# EasyEDA Pro project luoye-recorder-pcb-2026-07-16.epro, board AI BOARD
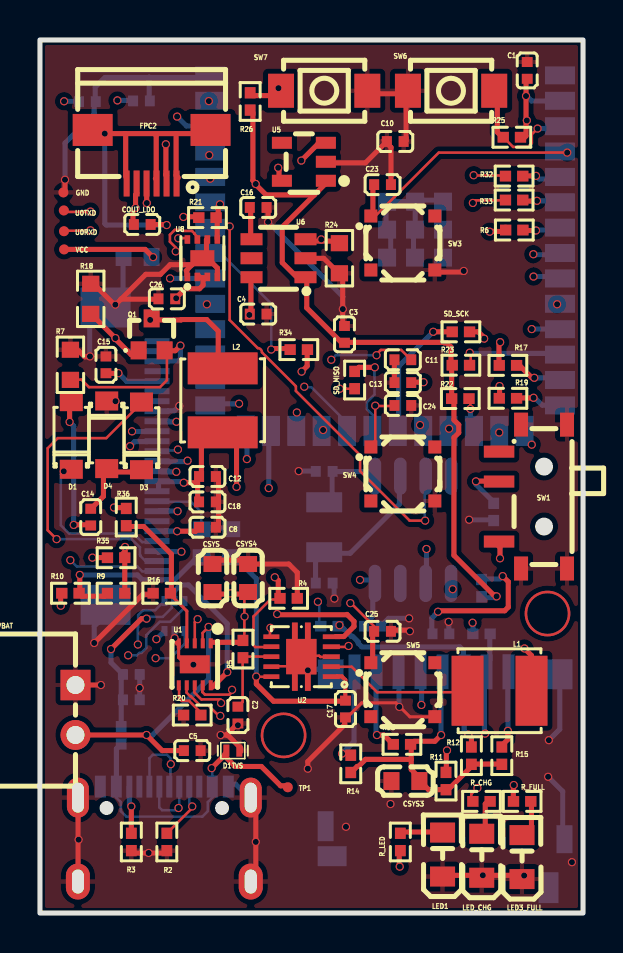
[diagram p2: board, top side]
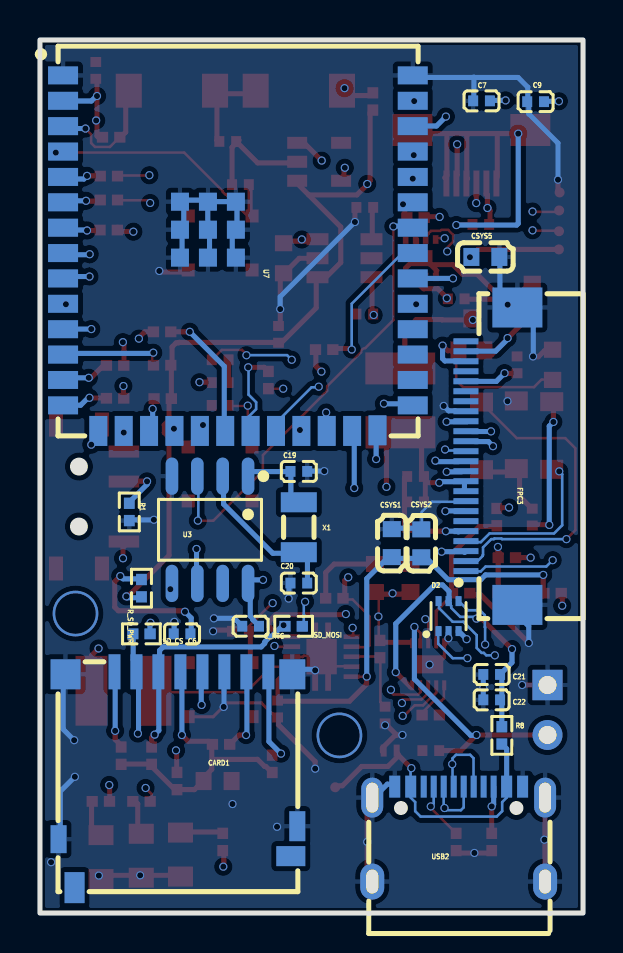
[diagram p3: board, bottom side, seen from below]

Outline 27.18 x 43.69 mm; copper layers: Top Layer, Inner1, Inner2, Inner3, Inner4, Bottom Layer. Coordinates in mm from the lower left corner of the outline.
Outline path: rectangle 0,43.69 27.18,0
Stack: Top Layer 0.035mm Outer layer thickness 1oz / Dielectric1 0.0994mm 3313 RC57% 4.2mil / Inner1 0.0152mm Inner layer thickness / Dielectric2 0.55mm 0.55mm H/H No copper / Inner2 0.0152mm Inner layer thickness / Dielectric3 0.1088mm 2116 RC54% 4.9mil / Inner3 0.0152mm Inner layer thickness / Dielectric4 0.55mm 0.55mm H/H No copper / Inner4 0.0152mm Inner layer thickness / Dielectric5 0.0994mm 3313 RC57% 4.2mil / Bottom Layer 0.035mm Outer layer thickness 1oz

## Design rules (mm)
spacing copperThickness1oz (default): track to track 0.102, other pairs 0.152 to 0.3
spacing copperThickness2oz: track to track 0.203, other pairs 0.152 to 0.3
track width copperThickness1oz (default): min 0.127, default 0.254, max 2.54
track width copperThickness2oz: min 0.203, default 0.254, max 2.54
differential pair differentialPair (default): width min 0.127, default 0.254, max 2.54; gap min 0.152, default 0.152
net GND uses copperRegion

## Placement (name value [footprint] x y rotation side)
C1  1uF  [C0402]  24.38 42.16 90 top
C2  100nF  [C0402]  9.91 9.91 270 top
C3  100nF  [C0402]  15.24 28.96 270 top
C4  1uF  [C0402]  10.92 29.97 180 top
C5  1uF  [C0402]  7.62 8.13 0 top
C6  100nF  [C0402]  20.07 13.97 180 bottom
C7  1uF  [C0402]  5.08 40.64 180 bottom
C8  1uF  [C0402]  8.38 19.3 180 top
C9  1uF  [C0402]  2.37 40.6 180 bottom
C10  1uF  [C0402]  17.78 38.61 0 top
C11  1uF  [C0402]  18.16 27.69 0 top
C12  4.7uF  [C0402]  8.38 21.84 0 top
C13  1uF  [C0402]  18.16 26.54 0 top
C14  4.7uF  [C0402]  2.54 19.81 90 top
C15  1uF  [C0402]  3.3 27.43 90 top
C16  10nF  [C0402]  10.92 35.31 180 top
C17  1uF  [C0402]  15.29 10.21 90 top
C18  4.7uF  [C0402]  8.38 20.57 180 top
C19  12pF  [C0402]  14.22 22.1 0 bottom
C20  12pF  [C0402]  14.22 16.51 180 bottom
C21  2.2uF  [C0402]  4.57 11.94 180 bottom
C22  100nF  [C0402]  4.57 10.67 180 bottom
C23  100nF  [C0402]  17.14 36.45 0 top
C24  100nF  [C0402]  18.16 25.4 0 top
C25  100nF  [C0402]  17.14 14.1 0 top
C26  100nF  [C0402]  6.35 30.73 0 top
C_RTC  100nF  [C0402]  16.64 14.35 0 bottom
CARD1  DM3D-SF  [TF-SMD_DM3D-SF]  20.27 6.67 0 bottom
CN_VBAT  ZX-XH2.54-2PWZ  [CONN-TH_2P-P2.50_ZX-XH2.54-2PWZ]  1.78 10.16 270 top
COUT_LDO  1uF  [C0402]  5.12 34.46 180 top
CSYS  10uF  [C0603]  8.64 16.76 270 top
CSYS1  10uF  [C0603]  9.57 18.51 270 bottom
CSYS2  10uF  [C0603]  8.09 18.5 270 bottom
CSYS3  10uF  [C0603]  18.29 6.6 0 top
CSYS4  10uF  [C0603]  10.41 16.76 90 top
CSYS5  10uF  [C0603]  4.89 32.83 0 bottom
D1  MBR0530  [SOD-123_L2.8-W1.8-LS3.7-RD]  1.57 23.9 90 top
D1TVS  H5VL10B  [SOD-882_L1.0-W0.6-BI]  9.65 8.13 180 top
D2  USBLC6-2P6-MS  [SOT-666-6_L1.6-W1.2-P0.50-LS1.6-BL]  6.73 14.86 180 bottom
D3  MBR0530  [SOD-123_L2.8-W1.8-LS3.7-RD]  5.08 23.88 90 top
D4  MBR0530  [SOD-123_L2.8-W1.8-LS3.7-RD]  3.34 23.93 270 top
FPC2  AFC01-S06FCA-00  [FPC-SMD_P0.50-6P_AFC01-S06FCA-00]  5.59 37.85 180 top
FPC3  FPC-05F-24PH20  [FPC-SMD_24P-P0.50_FPC-05F-24PH20]  4.57 22.86 90 bottom
GND  -  [Test-Point-0.5mm]  1.17 36.06 0 top
L1  2.2uH  [IND-SMD_L4.0-W4.0]  23 11.12 180 top
L2  47uH  [IND-SMD_L4.0-W4.0]  9.14 25.65 270 top
LED1  NCD0805R1  [LED0805-RD]  20.15 2.93 90 top
LED3_FULL  NCD0805R1  [LED0805-RD]  24.12 2.8 90 top
LED_CHG  NCD0805R1  [LED0805-RD]  22.11 2.87 90 top
Q1  SI1308EDL-VB  [SOT-323_L2.0-W1.3-P1.30-LS2.1-BR]  5.59 28.96 270 top
R1  100kΩ  [R0402]  22.71 20.07 90 bottom
R2  5.1kΩ  [R0402]  6.35 3.56 90 top
R3  5.1kΩ  [R0402]  4.57 3.56 270 top
R4  100kΩ  [R0402]  12.45 15.75 180 top
R5  100Ω  [R0402]  10.16 13.21 270 top
R6  100kΩ  [R0402]  23.74 34.18 0 top
R7  2.2Ω  [R0603]  1.52 27.43 270 top
R8  0Ω  [R0402]  4.06 8.89 90 bottom
R9  10kΩ  [R0402]  3.81 16 0 top
R10  10kΩ  [R0402]  1.52 16 0 top
R11  10kΩ  [R0402]  20.32 6.6 270 top
R12  10kΩ  [R0402]  21.59 7.87 270 top
R13  10kΩ  [R0402]  18.11 8.44 0 top
R14  10kΩ  [R0402]  15.55 7.47 270 top
R15  10kΩ  [R0402]  23.11 7.87 270 top
R16  10kΩ  [R0402]  6.1 16 180 top
R17  0Ω  [R0402]  23.42 27.41 0 top
R18  1MΩ  [R0603]  2.54 30.73 270 top
R19  0Ω  [R0402]  23.42 25.76 0 top
R20  10kΩ  [R0402]  7.62 9.91 0 top
R21  10kΩ  [R0402]  8.38 34.8 0 top
R22  10kΩ  [R0402]  21.04 25.74 0 top
R23  10kΩ  [R0402]  21.06 27.41 0 top
R24  100kΩ  [R0603]  14.99 32.77 90 top
R25  10kΩ  [R0402]  23.62 38.82 0 top
R26  10kΩ  [R0402]  10.52 40.61 270 top
R32  22Ω  [R0402]  23.73 36.87 180 top
R33  22Ω  [R0402]  23.73 35.68 180 top
R34  0Ω  [R0402]  12.95 28.19 0 top
R35  0Ω  [R0402]  3.81 17.78 0 top
R36  0Ω  [R0402]  4.32 19.81 270 top
R_CHG  2.2kΩ  [R0402]  22.1 5.59 0 top
R_FULL  2.2kΩ  [R0402]  24.13 5.59 0 top
R_LED  2.2kΩ  [R0402]  18.03 3.56 90 top
R_SD_PWR  0Ω  [R0402]  22.1 16.26 90 bottom
SD_CS  22Ω  [R0402]  22.1 13.97 0 bottom
SD_MISO  22Ω  [R0402]  15.75 26.67 270 top
SD_MOSI  22Ω  [R0402]  14.48 14.35 0 bottom
SD_SCK  22Ω  [R0402]  21.07 29.08 0 top
SW1  MSK12C02  [SW-TH_MSK12C02]  24.68 20.84 90 top
SW3  U34B352210  [SW-SMD_4P-L3.7-W3.7-P2.70-LS3.7]  18.16 33.53 0 top
SW4  U34B352210  [SW-SMD_4P-L3.7-W3.7-P2.70-LS3.7]  18.16 21.97 0 top
SW5  U34B352210  [SW-SMD_4P-L3.7-W3.7-P2.70-LS3.7]  18.16 11.18 0 top
SW6  HX 3x4x2-2P-1.6N TACTILE SWITCH  [KEY-SMD_L4.0-W3.0-LS4.9-1]  20.57 41.15 0 top
SW7  HX 3x4x2-2P-1.6N TACTILE SWITCH  [KEY-SMD_L4.0-W3.0-LS4.9-1]  14.22 41.15 180 top
TP1  -  [Test-Point-0.5mm]  12.4 6.29 90 top
U0RXD  -  [Test-Point-0.5mm]  1.2 34.12 0 top
U0TXD  -  [Test-Point-0.5mm]  1.19 35.16 0 top
U1  BQ25186DLHR  [WSON-10_L2.2-W2.0-P0.40-BL-EP_TI_DLH0010A]  7.75 12.45 180 top
U2  TPS63001DRCR  [VSON-10_L3.0-W3.0-P0.50-TL-EP_TPS62410DRCR]  13.08 12.83 180 top
U3  PCF8563T(UMW)  [SOP-8_L4.9-W3.9-P1.27-LS6.0-BL]  18.67 19.18 0 bottom
U5  TPS7A2033PDBVR  [SOT-23-5_L2.9-W1.6-P0.95-LS2.8-BR]  13.21 37.59 0 top
U6  TPS22918DBVR  [SOT-23-6_L2.9-W1.6-P0.95-LS2.8-BR]  11.94 32.77 0 top
U7  2.4GHz  [WIRELM-SMD_ESP32-S3-WROOM-1U]  17.27 33.02 180 bottom
U8  MAX17048G+T10  [TDFN-8_L2.0-W2.0-P0.50-BL-EP1.2]  8.13 32.77 0 top
USB2  TYPE-C 16PIN 2MD(073)  [USB-C-SMD_TYPE-C-16PIN-2MD-073]  6.22 3.95 180 bottom
VCC  -  [Test-Point-0.5mm]  1.21 33.21 270 top
X1  32.768kHz  [FC-135R_L3.2-W1.5]  14.22 19.3 90 bottom

## Footprints (pads in the part's own frame, mm; a bottom-side part is the same pattern mirrored in y, then rotated)
C0402
  rect 0.5x0.54 smd: 1(-0.42,0) 2(0.42,0)
C0603
  rect 0.8x0.9 smd: 1(-0.7,0) 2(0.7,0)
CONN-TH_2P-P2.50_ZX-XH2.54-2PWZ
  rect 1.524x1.5 hole 0.9: 1(-1.25,0)
  round 1.5 hole 0.9: 2(1.25,0)
FC-135R_L3.2-W1.5
  rect 1x1.8 smd: 1(-1.25,0) 2(1.25,0)
FPC-SMD_24P-P0.50_FPC-05F-24PH20
  rect 0.3x1.25 smd: 1(-5.75,1.288) 2(-5.25,1.288) 3(-4.75,1.288) 4(-4.25,1.288) 5(-3.75,1.288) 6(-3.25,1.288) 7(-2.75,1.288) 8(-2.25,1.288) 9(-1.75,1.288) 10(-1.25,1.288) 11(-0.75,1.288) 12(-0.25,1.288) 13(0.25,1.288) 14(0.75,1.288) 15(1.25,1.288) 16(1.75,1.288) 17(2.25,1.288) 18(2.75,1.288) 19(3.25,1.288) 20(3.75,1.288) 21(4.25,1.288) 22(4.75,1.288) 23(5.25,1.288) 24(5.75,1.288)
  rect 2x2.5 smd: 25(7.44,-1.288) 26(-7.44,-1.288)
FPC-SMD_P0.50-6P_AFC01-S06FCA-00
  rect 0.3x1.3 smd: 1(-1.248,1.339) 2(-0.748,1.339) 3(-0.248,1.339) 4(0.252,1.339) 5(0.752,1.339) 6(1.252,1.339)
  rect 2x1.6 smd: 7(-2.95,-1.339) 8(2.95,-1.339)
IND-SMD_L4.0-W4.0
  rect 1.6x3.5 smd: 1(-1.6,0) 2(1.6,0)
KEY-SMD_L4.0-W3.0-LS4.9-1
  rect 1.3x1.7 smd: 1(-2.159,0) 2(2.159,0)
LED0805-RD
  rect 1x1.25 smd: 1(-1.1,0) 2(1.1,0)
R0402
  rect 0.566x0.54 smd: 1(-0.433,0) 2(0.433,0)
R0603
  rect 0.806x0.864 smd: 1(-0.753,0) 2(0.753,0)
SOD-123_L2.8-W1.8-LS3.7-RD
  rect 0.95x1.15 smd: 1(-1.692,0) 2(1.692,0)
SOD-882_L1.0-W0.6-BI
  rect 0.3x0.6 smd: 1(-0.325,0) 2(0.325,0)
SOP-8_L4.9-W3.9-P1.27-LS6.0-BL
  oval 0.63x1.865 smd: 1(-1.905,-2.683) 2(-0.635,-2.683) 3(0.635,-2.683) 4(1.905,-2.683) 5(1.905,2.683) 6(0.635,2.683) 7(-0.635,2.683) 8(-1.905,2.683)
SOT-23-5_L2.9-W1.6-P0.95-LS2.8-BR
  rect 1x0.6 smd: 1(1.1,-0.95) 2(1.1,0) 3(1.1,0.95) 4(-1.1,0.95) 5(-1.1,-0.95)
SOT-23-6_L2.9-W1.6-P0.95-LS2.8-BR
  rect 1.1x0.6 smd: 1(1.35,-0.95) 2(1.35,0) 3(1.35,0.95) 4(-1.35,0.95) 5(-1.35,0) 6(-1.35,-0.95)
SOT-323_L2.0-W1.3-P1.30-LS2.1-BR
  rect 0.9x0.8 smd: 1(0.8,-0.65) 2(0.8,0.65) 3(-0.8,0)
SOT-666-6_L1.6-W1.2-P0.50-LS1.6-BL
  rect 0.3x0.5 smd: 1(-0.5,-0.75) 2(0,-0.75) 3(0.5,-0.75) 4(0.5,0.75) 5(0,0.75) 6(-0.5,0.75)
SW-SMD_4P-L3.7-W3.7-P2.70-LS3.7
  rect 0.65x0.65 smd: 1(-1.6,1.35) 2(1.6,1.35) 3(-1.6,-1.35) 4(1.6,-1.35)
SW-TH_MSK12C02
  rect 0.6x1.524 smd: 1(-2.25,1.7) 2(0.75,1.7) 3(2.25,1.7)
  rect 1.2x0.7 smd: 4(-3.6,0.6) 4(-3.6,-1.7) 4(3.6,0.6) 4(3.6,-1.7)
TDFN-8_L2.0-W2.0-P0.50-BL-EP1.2
  rect 0.28x0.425 smd: 1(-0.75,-0.938) 2(-0.25,-0.938) 3(0.25,-0.938) 4(0.75,-0.938) 5(0.75,0.938) 6(0.25,0.938) 7(-0.25,0.938) 8(-0.75,0.938)
  rect 1.2x0.8 smd: 9(0,0)
Test-Point-0.5mm
  round 0.5 smd: 1(0,0)
TF-SMD_DM3D-SF
  rect 0.6x1.75 smd: 1(3.175,-5.4) 2(2.075,-5.4) 3(0.975,-5.4) 4(-0.125,-5.4) 5(-1.225,-5.4) 6(-2.325,-5.4) 7(-3.425,-5.4) 8(-4.525,-5.4)
  rect 1.45x1 smd: 9(-5.65,3.825)
  rect 1x1.55 smd: 10(5.175,5.4)
  rect 0.8x1.5 smd: 11(-5.975,2.325)
  rect 0.8x1.4 smd: 12(5.975,2.975)
  rect 1.5x1.5 smd: 13(5.625,-5.275)
  rect 1.3x1.5 smd: 14(-5.725,-5.275)
USB-C-SMD_TYPE-C-16PIN-2MD-073
  oval 1.2x1.8 hole 0.6x1.2: 13(-4.325,-2.375) 14(4.325,-2.375)
  oval 1.1x2 hole 0.6x1.5: 13(-4.325,1.825) 14(4.325,1.825)
  rect 0.55x1.1 smd: A1B12(-3.2,2.375) A4B9(-2.4,2.375) B1A12(3.2,2.375) B4A9(2.4,2.375)
  rect 0.3x1.1 smd: A5(-1.25,2.375) A6(-0.25,2.375) A7(0.25,2.375) A8(1.25,2.375) B5(1.75,2.375) B6(0.75,2.375) B7(-0.75,2.375) B8(-1.75,2.375)
VSON-10_L3.0-W3.0-P0.50-TL-EP_TPS62410DRCR
  rect 0.85x0.24 smd: 1(-1.5,1) 2(-1.5,0.5) 3(-1.5,0) 4(-1.5,-0.5) 5(-1.5,-1)
  rect 0.8x0.23 smd: 6(1.5,-1) 7(1.5,-0.5) 8(1.5,0) 9(1.5,0.5) 10(1.5,1)
  custom 1.52x3.42 smd: 11(0,-0.005)
WIRELM-SMD_ESP32-S3-WROOM-1U
  rect 1.5x0.9 smd: 1(-8.75,8.895) 2(-8.75,7.625) 3(-8.75,6.355) 4(-8.75,5.085) 5(-8.75,3.815) 6(-8.75,2.545) 7(-8.75,1.275) 8(-8.75,0.005) 9(-8.75,-1.265) 10(-8.75,-2.535) 11(-8.75,-3.805) 12(-8.75,-5.075) 13(-8.75,-6.345) 14(-8.75,-7.615) 27(8.75,-7.615) 28(8.75,-6.345) 29(8.75,-5.075) 30(8.75,-3.805) 31(8.75,-2.535) 32(8.75,-1.265) 33(8.75,0.005) 34(8.75,1.275) 35(8.75,2.545) 36(8.75,3.815) 37(8.75,5.085) 38(8.75,6.355) 39(8.75,7.625) 40(8.75,8.895)
  rect 0.9x1.5 smd: 15(-6.985,-8.895) 16(-5.715,-8.895) 17(-4.445,-8.895) 18(-3.175,-8.895) 19(-1.905,-8.895) 20(-0.635,-8.895) 21(0.635,-8.895) 22(1.905,-8.895) 23(3.175,-8.895) 24(4.445,-8.895) 25(5.715,-8.895) 26(6.985,-8.865)
  rect 0.9x0.9 smd: 41(-2.9,-0.225) 41(-2.9,1.175) 41(-2.9,2.575) 41(-1.5,-0.225) 41(-1.5,1.175) 41(-1.5,2.575) 41(-0.1,-0.225) 41(-0.1,1.175) 41(-0.1,2.575)
WSON-10_L2.2-W2.0-P0.40-BL-EP_TI_DLH0010A
  rect 0.2x0.5 smd: 1(-0.8,-1.05) 2(-0.4,-1.05) 3(0,-1.05) 4(0.4,-1.05) 5(0.8,-1.05) 6(0.8,1.05) 7(0.4,1.05) 8(0,1.05) 9(-0.4,1.05) 10(-0.8,1.05)
  rect 1.5x0.9 smd: 11(0,0)

## Nets
3.3V_MIC: COUT_LDO.2 FPC2.5 U5.5
AGND: COUT_LDO.1 FPC2.1 FPC2.3 FPC2.6 FPC2.7 FPC2.8 R6.1
GND: C1.2 C2.2 C3.1 C4.1 C5.2 C6.1 C7.1 C8.1 C9.1 C10.1 C10.2 C11.1 C12.2 C13.1 C15.2 C16.1 C17.1 C18.1 C19.1 C20.1 C21.1 C22.1 C23.2 C24.2 C25.2 C26.1 C_RTC.2 CARD1.6 CARD1.11 CARD1.12 CARD1.13 CARD1.14 CN_VBAT.1 CSYS.1 CSYS1.1 CSYS2.1 CSYS3.1 CSYS4.2 CSYS5.1 D1TVS.1 D2.2 D4.1 FPC3.8 FPC3.17 FPC3.25 FPC3.26 GND.1 LED1.1 LED3_FULL.1 LED_CHG.1 R1.1 R2.1 R3.2 R4.1 R7.1 R16.2 R18.1 R20.1 R24.1 SW1.4 SW3.4 SW4.4 SW5.4 SW6.1 SW7.1 U1.5 U1.11 U2.3 U2.9 U2.11 U3.4 U5.2 U6.2 U7.1 U7.40 U7.41 U8.1 U8.4 U8.6 U8.9 USB2.13 USB2.14 USB2.A1B12 USB2.B1A12
VBAT+: C26.2 C_RTC.1 U3.8 U8.2 U8.3
VCC: C1.1 C3.2 C17.2 CSYS1.2 CSYS2.2 CSYS5.2 R9.1 R10.2 R21.1 R22.1 R23.1 R25.2 R26.2 R_SD_PWR.1 U2.1 U2.10 U5.1 U6.1 U7.2 VCC.1
VCC_EPD: C4.2 C12.1 C18.2 FPC3.9 FPC3.10 L2.2 U6.6
VCC_SD: C6.2 CARD1.4 CSYS3.2 R11.2 R12.2 R13.2 R14.2 R15.2 R_SD_PWR.2
BACK_KEY: C25.1 SW5.1 U7.39
BAT+: C5.1 CN_VBAT.2 U1.2
BAT_ALRT: R21.2 U7.35 U8.5
BOOT: R26.1 SW7.2 U7.27
BQ_CE_N: R16.1 R36.2 U1.4
BQ_INT_N: R9.2 R35.2 U1.9
BQ_PG_N: R10.1 R34.2 U1.3
CHG_LED: R_CHG.1 U7.9
EPD_BUSY: FPC3.16 U7.22
EPD_CS: FPC3.13 U7.18
EPD_DC: FPC3.14 U7.11
EPD_MOSI: FPC3.11 U7.16
EPD_POWER_EN: R24.2 U6.3 U7.24
EPD_RST: FPC3.15 U7.23
EPD_SCLK: FPC3.12 U7.15
FULL_LED: R_FULL.1 U7.26
GDR: FPC3.23 Q1.1 R18.2
I2C_SCL: R22.2 U1.7 U3.6 U7.17 U8.7
I2C_SDA: R23.2 U1.8 U3.5 U7.12 U8.8
MARK_KEY: C24.1 SW4.1 U7.38
MIC_LDO_EN: R6.2 U5.3 U7.7
PDM_CLK: FPC2.2 R32.2
PDM_DATA: FPC2.4 R33.2
PREVGH: C13.2 D1.1 FPC3.4
PREVGL: D3.2 FPC3.2
PWR_MODE: R4.2 U2.7 U7.8
REC_KEY: C23.1 SW3.1 U7.4
REC_LED: R_LED.1 U7.25
RESE: FPC3.22 Q1.2 R7.2
RESET: R25.1 SW6.2 U7.3
RTC_INT: U3.3 U7.34
SD_CS: SD_CS.1 U7.10
SD_MISO: SD_MISO.1 U7.21
SD_MOSI: SD_MOSI.1 U7.19
SD_SCK: SD_SCK.1 U7.20
SYS_PWR: CSYS.2 CSYS4.1 R5.1 SW1.1 U1.1 U2.5
USB_5V_PROT: C21.2 C22.2 D2.5 R8.2 U1.10
USB_D+: D2.6 R19.1
USB_D-: D2.4 R17.1
VCOM: C11.2 FPC3.1
$1N2: D1TVS.2 R8.1 TP1.1 USB2.A4B9 USB2.B4A9
$1N5: D2.1 USB2.A6 USB2.B6
$1N6: D2.3 USB2.A7 USB2.B7
$1N18: R2.2 USB2.A5
$1N43: R1.2 SW1.2 U2.6
$1N49: C2.1 R5.2 U2.8
$1N50: L1.1 U2.4
$1N51: L1.2 U2.2
$1N121: CARD1.2 R11.1 SD_CS.2
$1N122: CARD1.3 R12.1 SD_MOSI.2
$1N123: CARD1.5 SD_SCK.2
$1N125: CARD1.1 R15.1
$1N127: CARD1.7 R13.1 SD_MISO.2
$1N184: C7.2 FPC3.7
$1N185: C8.2 FPC3.5
$1N188: C9.2 FPC3.3
$1N199: C14.2 D3.1 D4.2
$1N200: C14.1 D1.2 L2.1 Q1.3
$1N212: C15.1 FPC3.20
$1N218: C16.2 U6.4
$1N241: CARD1.8 R14.1
$1N256: C20.2 U3.2 X1.1
$1N257: C19.2 U3.1 X1.2
$1N288: LED1.2 R_LED.2
$1N294: LED_CHG.2 R_CHG.2
$1N297: LED3_FULL.2 R_FULL.2
$1N309: R20.2 U1.6
$1N348: U0RXD.1 U7.36
$1N355: U0TXD.1 U7.37
$1N383: R32.1 U7.5
$1N385: R33.1 U7.6
$1N388: R34.1 U7.33
$1N390: R35.1 U7.32
$1N392: R36.1 U7.31
$1N397: R17.2 U7.13
$1N398: R19.2 U7.14
$1N405: R3.1 USB2.B5

Pads without a net: CARD1 9 10; FPC3 6 18 19 21 24; SW1 3; SW3 2 3; SW4 2 3; SW5 2 3; U3 7; U5 4; U6 5; U7 28 29 30; USB2 A8 B8

## Via types
v1: diameter 2.286, hole 2.032, Top Layer to Bottom Layer, 2 vias
v2: diameter 0.409, hole 0.305, Top Layer to Bottom Layer, 177 vias

## Routing (per net, layer and track width the routed paths; a pad name or vN(x,y) marks a point on that pad's centre or on a via; arc(x,y) is an arc through that point)
3.3V_MIC: length 10.8
  Top Layer w0.254: 11.89,37.25 11.96,37.18 11.96,36.65 ; 4.66,34.5 4.66,35.15 v2(4.78,35.28) 4.78,35.94 4.85,36.01
  Inner1 w0.254: v2(11.92,37.29) 5.73,37.29 4.78,36.35 v2(4.78,35.28)
AGND: length 45
  Top Layer w0.254: 5.77,38.95 5.82,38.9 5.82,36.75 5.78,36.75 ; 6.92,36.79 6.81,36.9 6.81,39 ; 8.18,39.06 8.12,39 6.81,39 ; v2(6.34,34.43) 6.32,34.45 5.55,34.45 ; 4.26,39 4.29,38.97 4.29,36.84 ; 4.26,39 4.25,39.01 ; 4.26,39 6.81,39 ; 4.26,39 v2(3.24,39) ; 22.59,34.11 23.09,34.11 23.3,34.32
  Inner2 w0.254: 3.19,39.04 3.22,39.01 22.33,39.01 22.51,38.83 v2(22.51,34.09)
  Bottom Layer w0.254: v2(6.34,34.43) 3.32,34.43 3.24,34.5 v2(3.24,39)
GND: length 130.1
  Top Layer w0.127: 14.31,12.85 14.27,12.81 14.03,12.81 13.97,12.87 13.57,12.87 ; 11.89,12.35 12.81,12.35 12.93,12.47
  Top Layer w0.152: 6.94,13.5 6.94,12.79 7.11,12.61 ; 19.66,9.82 18.51,9.82 17.81,10.52 16.1,10.52 15.38,9.8
  Top Layer w0.254: 2.5,27.83 2.24,27.83 1.94,28.13 1.58,28.13 ; 6.73,13.77 6.73,13.66 6.91,13.48 ; 9.33,8.91 C2.2 ; 9.33,8.91 9.39,8.91 10.04,8.26 10.04,8.08 ; 9.33,8.91 v2(9.04,8.91) ; v2(2.71,13.51) 5.13,15.93 5.63,15.93 ; 16.53,41 18.27,41 18.33,41.06 ; 1.91,5.02 1.91,1.48 ; 14.83,32.13 14.2,32.76 13.5,32.76 ; 15.11,31.89 15.15,31.85 15.15,29.44 ; 14.07,37.54 16.28,37.54 17.32,38.57 ; 8.48,17.66 10.16,17.66 10.39,17.44 ; 2.62,31.55 3.73,30.44 ; 15.25,9.76 15.25,9.42 13.41,7.58 v2(13.41,7.22) ; 7.32,32.15 7.62,32.44 ; 7.62,32.44 7.97,32.8 ; 7.62,32.44 6.51,32.44 6.03,31.96 5.3,31.96 4.05,30.71 ; 24.34,1.69 24.14,1.89 v2(22.16,1.89) 20.03,1.89 ; 1.25,36.11 v2(1.25,36.7) ; v2(11.42,34.58) 11.42,35.2 11.34,35.27 ; 18.32,40.62 18.32,38.65 18.25,38.58 ; 10.8,5.52 v2(10.8,3.56) 10.8,1.66 10.54,1.4 ; 8.88,31.95 8.88,32.27 8.44,32.71 ; 8.79,19.3 8.94,19.45 8.94,21.78 ; v2(21.21,32.13) 21.15,32.07 19.81,32.07 ; 17.32,38.57 17.21,38.67 ; 17.32,38.57 17.57,38.32 17.57,36.46 ; 10.67,17.46 12.46,17.46 12.88,17.04 12.88,15.83 ; 3.81,30.48 4.05,30.71 ; 4.05,30.71 5.8,30.71 ; 8.33,33.71 8.33,32.87 ; v2(18.51,14.1) 18.46,14.16 17.57,14.16 ; 6.47,3.03 6.44,3 4.69,3 ; 17.74,27.58 17.74,26.48 17.77,26.44 ; 7.35,31.91 7.35,32.11 ; v2(3.05,11.41) CN_VBAT.1
  Inner2 w0.254: v2(3.78,25.61) 4.01,25.37 v2(6.97,25.37)
  Bottom Layer w0.127: 8.07,19.29 8.07,20.06 7.56,20.58 6.02,20.58
  Bottom Layer w0.254: 20.29,32.86 20.07,33.08 20.07,33.99 ; v2(25.47,8.65) 26.01,9.19 26.01,11.71 ; 19.98,35.59 19.98,34.21 ; 3.22,14.85 2.71,14.35 v2(2.71,13.51) ; C21.1 v2(4.99,11.26) C22.1 ; 9.55,6.45 9.79,6.45 10.58,5.66 ; 6.72,13.76 6.75,13.79 6.75,14.03 ; 17.97,11.49 17.97,10.33 v2(17.98,10.31) ; 17.42,32.86 17.55,33 17.55,33.96 ; 3.76,30.45 4.16,30.85 4.16,32.84 ; v2(14.73,15.73) 14.72,15.75 14.72,16.52 ; 18.69,34.05 18.69,32.85 18.78,32.76 ; 5.46,40.73 5.46,41.81 ; 5.46,41.81 3.25,41.81 2.76,41.33 2.76,40.77 ; 5.46,41.81 5.46,41.84 ; 5.46,41.81 8.12,41.81 ; 18.78,35.51 18.78,34.07 ; 17.5,35.6 18.69,35.6 ; v2(21.48,19.68) 21.48,19.67 22.61,19.67 ; 14.23,12.2 13.43,12.2 13.34,12.1 ; v2(25.43,6.82) 26.16,6.09 26.16,3.86 ; 17.32,34.32 17.32,35.38 17.5,35.56 ; 18.85,35.67 18.88,35.67 ; 18.88,35.67 18.94,35.73 ; 18.88,35.67 19.86,35.67 ; v2(18.47,14.75) 17.45,14.75 17.18,14.47 ; v2(11.42,34.58) 15.16,30.84 v2(15.16,30.22) ; 2.7,29.64 2.49,29.43 2.49,27.87 ; v2(20.45,14.57) 20.46,14.56 20.46,14.09 ; 9.56,19.21 9.51,19.26 8.17,19.26 ; v2(1.25,36.7) 1.25,38.53 2.71,39.99 2.71,40.61 ; 13.82,22.11 v2(12.95,22.11) ; v2(6.97,25.37) 6.73,25.13 6.41,25.13 6.37,25.1 ; 18.75,34.1 18.73,34.07
  vias: v2(1.93,3.67) v2(2.5,27.85) v2(3.77,30.44) v2(5.44,3.01) v2(6.74,13.76) v2(7.68,12.43) v2(9.91,9.4) v2(13.41,12.15) v2(15.31,4.31) v2(17.54,5.45) v2(24.23,1.88) v2(26.62,2.54)
VBAT+: length 32.2
  Top Layer w0.254: 6.96,30.94 7.27,31.24 7.98,31.24 8.16,31.42 8.16,31.7 ; 7.91,31.83 7.99,31.83 8.03,31.8 8.34,31.8
  Inner1 w0.127: v2(6.82,30.76) 6.89,30.69 7.99,30.69 8.18,30.88 8.53,30.88 8.77,30.64 8.77,30.29 8.53,30.04 7.9,30.04 6.82,28.96 6.82,28.77 6.61,28.57 6.61,27.48 3.71,24.58 3.71,23.57 5.54,21.73 6.4,21.73 7.91,20.23 8.92,20.23 12.48,16.67 v2(16.02,16.67)
  Bottom Layer w0.254: 16.65,16.33 16.65,14.86 16.53,14.74 16.53,14.68 16.19,14.35 ; v2(16.02,16.67) 16.58,16.67 16.91,16.99
VCC: length 114.3
  Top Layer w0.127: v2(10.82,11.83) 10.83,11.82 11.33,11.82
  Top Layer w0.203: 14.85,11.82 14.87,11.84 15.11,11.84 15.28,11.66 15.28,10.66
  Top Layer w0.254: 20.57,27.39 20.57,28.32 20.36,28.53 20.23,28.53 20.21,28.56 15.38,28.56 ; 1.25,33.21 5.27,33.21 5.66,32.81 ; 13.73,35.93 11.32,35.93 10.82,36.43 ; 13.73,35.93 14.47,36.68 ; 13.73,35.93 12.13,34.33 12.13,32.55 12.92,31.76 ; v2(1.99,16.92) 1.99,16.07 2.04,16.02 ; 2.08,15.85 3.23,15.85 3.31,15.94 ; 7.9,34.84 7.11,34.84 ; 20.72,25.6 20.72,24.67 20.96,24.43 20.96,24.03 20.72,23.79 20.72,17.9 22.69,15.93 22.77,15.93 ; 24.32,40.77 24.32,38.88 24.2,38.76 ; 24.32,41.69 v2(24.32,40.88) ; 10.83,11.72 10.83,11.46 11.69,10.6 15.16,10.6 ; 13.35,31.66 13.35,30.28 15.14,28.49 ; 10.66,40.07 10.66,36.66 10.81,36.5 ; 20.6,27.3 20.6,25.77
  Inner1 w0.254: 24.4,39.62 24.4,37.31 23.57,36.48 21.95,36.48 21.9,36.44 21.5,36.44 21.46,36.48 v2(10.8,36.48) ; 22.89,15.83 20.96,15.83 20.85,15.72 20.45,15.72 19.83,16.35 19.83,18.42 19.54,18.7 19.14,18.7 18.86,18.42 18.86,18.15 15.73,15.02 14.05,15.02 10.85,11.82
  Inner2 w0.254: 5.71,32.82 6.4,32.82 6.6,32.62 7,32.62 8.53,34.15 8.53,35.67 8.81,35.95 8.84,35.95 9.4,36.51 10.9,36.51
  Inner4 w0.254: 5.74,32.85 5.86,32.97 5.86,34.63 6.14,34.91 6.54,34.91 6.62,34.83 v2(7.18,34.83)
  Bottom Layer w0.254: 24.32,40.92 24.6,40.63 25.66,40.63 ; 7.83,17.76 6.75,16.68 5.12,16.68 4.88,16.92 v2(1.99,16.92) ; 22.84,15.84 22.79,15.78 21.99,15.78 ; 9.69,17.71 9.65,17.75 8.25,17.75 ; 9.77,17.78 10.82,16.73 v2(10.82,11.83)
  vias: v2(5.66,32.82) v2(22.85,15.84) v2(24.37,39.66)
VCC_EPD: length 45.4
  Top Layer w0.254: 7.89,21.53 7.89,20.68 7.94,20.63 ; 8.08,21.97 8.08,23.3 8.76,23.98 ; 10.54,29.91 10.56,29.93 10.56,31.66 ; 10.04,24.47 9.84,24.26 v2(9.84,21.33) ; v2(7.2,21.53) 7.71,21.53
  Inner4 w0.254: 9.79,21.29 7.07,18.56 6.8,18.56 4.39,16.15 2.08,16.15 1.04,17.19 1.04,17.86 1.32,18.14 1.59,18.14 2.94,19.49 2.94,20.2 1.98,21.16 1.98,26.77 1.3,27.44 1.3,29.65 1.8,30.15 3.38,30.15 3.57,29.96 3.97,29.96 4.18,30.16 5.71,30.16 5.73,30.15 5.8,30.15 6.01,29.94 10.48,29.94
  Bottom Layer w0.254: v2(7.2,21.53) 7.14,21.58 6.1,21.58 ; 5.88,21.58 5.93,21.53 5.93,21.12
  vias: v2(10.48,29.93)
VCC_SD: length 27.2
  Top Layer w0.254: 18.54,8.37 18.62,8.29 18.58,8.25 18.58,7.69 ; 19.11,6.51 19.45,6.17 20.29,6.17 ; 21.71,7.46 23.04,7.46 23.06,7.44 ; 18.94,6.83 18.58,7.19 18.58,7.69 ; 18.73,8.6 19.76,8.6 v2(20.08,8.91) ; 19.9,15.04 19.99,15.13 23.26,15.13 23.44,15.3 23.44,16.58 v2(23.16,16.86) ; 15.62,7.09 15.87,7.34 15.94,7.34 16.29,7.69 18.58,7.69 ; 20.44,6.18 21.58,7.32
  Inner1 w0.254: 20.03,8.93 19.92,9.04 v2(19.92,15.08)
  Bottom Layer w0.254: v2(19.92,15.08) 19.61,14.76 19.61,14.07 ; v2(20.08,8.91) 20.08,11.76 20.1,11.79 ; 22.2,16.72 23.02,16.72 v2(23.16,16.86)
(no net):
  vias: v1(12.19,8.89) v1(25.4,14.99)
BACK_KEY: length 50.7
  Top Layer w0.127: 15.58,15.53 15.58,15.49 16.79,14.29
  Top Layer w0.254: 16.65,12.65 16.65,14.07
  Inner3 w0.127: v2(15.53,15.51) 14.85,14.82 14.81,14.82 14.57,14.58 14.57,14.54 13.23,13.21 7.88,13.21 5.76,15.33 5.19,15.33 4.71,14.84 0.6,14.84 0.36,15.08 0.36,34.56 6.46,40.66 8.59,40.66
  vias: v2(8.45,40.63)
BAT+: length 13.5
  Top Layer w0.127: 8.14,13.61 8.14,14.02 v2(8.44,14.32)
  Top Layer w0.254: C5.1 6.12,8.13 v2(5.33,8.91) CN_VBAT.2
  Bottom Layer w0.254: v2(8.44,14.32) 8.44,11.71 5.62,8.89 5.33,8.89
BAT_ALRT: length 1.8
  Top Layer w0.254: 8.92,34.76 8.92,35.38 v2(9.01,35.47) ; 8.9,34.77 8.87,34.75 8.87,33.72
BOOT: length 19
  Top Layer w0.254: 10.67,40.9 11.8,40.9
  Inner3 w0.127: v2(11.94,41.28) 9.96,39.3 v2(9.96,25.49)
  Bottom Layer w0.254: 8.72,25.48 9.96,25.48 v2(9.96,25.49)
BQ_CE_N: length 7.3
  Top Layer w0.152: 7.35,13.54 7.35,15.11 6.56,15.9
  Top Layer w0.254: 4.34,19.34 5.19,19.34 6.58,17.96 6.58,16.2 6.53,16.15
BQ_INT_N: length 15.2
  Top Layer w0.127: v2(9.61,11.17) 9.6,11.16 9.6,11.05 9.49,10.93 8.25,10.93 8.13,11.06 8.13,11.22
  Top Layer w0.254: v2(4.26,18.32) 4.26,18.1 4.12,17.96 ; 4.24,17.8 4.24,16.14 4.4,15.98
  Inner1 w0.127: v2(9.61,11.17) 9.07,11.71 8.86,11.71 8.86,14.49 7.74,15.61 5.05,15.61 4.26,16.4 v2(4.26,18.32)
BQ_PG_N: length 24.7
  Top Layer w0.127: 7.75,13.55 7.75,14.56 7.89,14.7
  Top Layer w0.254: v2(1.04,15.38) 1.03,15.39 1.03,15.95 ; v2(13.09,27.09) 13.37,27.37 13.37,28.2
  Inner1 w0.127: v2(1.04,15.38) 7.17,15.38 7.86,14.68 7.86,14.67 7.89,14.65
  Inner3 w0.127: v2(13.09,27.09) 7.86,21.86 7.86,14.74
  vias: v2(7.89,14.71)
CHG_LED: length 31.5
  Top Layer w0.127: 21.58,5.55 21.58,5.95 v2(21.89,6.26)
  Inner2 w0.127: 21.98,6.3 26.78,11.11 26.78,31.76 26.69,31.85 v2(24.7,31.85)
  Bottom Layer w0.254: 25.75,31.88 25.72,31.85 v2(24.7,31.85)
EPD_BUSY: length 10.8
  Inner1 w0.127: v2(6.83,24.58) 7.88,24.58 9.64,26.34 v2(13.23,26.34)
  Bottom Layer w0.127: 15.25,24.65 13.58,26.31 13.29,26.31
  Bottom Layer w0.254: 5.8,24.58 v2(6.83,24.58)
EPD_CS: length 14.8
  Inner1 w0.127: v2(20.47,24.23) 19.43,23.19 v2(6.9,23.19)
  Bottom Layer w0.127: v2(6.9,23.19) 6.85,23.14 6.14,23.14
EPD_DC: length 26.3
  Inner1 w0.127: v2(4.51,23.36) 3.94,23.93 3.94,24.48 8.96,29.5 19.85,29.5 20.14,29.22 v2(24.61,29.22)
  Bottom Layer w0.254: 25.65,29.27 25.6,29.22 v2(24.61,29.22) ; 5.42,23.59 4.74,23.59 v2(4.51,23.36)
EPD_MOSI: length 18.1
  Inner1 w0.127: v2(22.99,24.04) 20.99,22.04 13.47,22.04 13.12,21.69 12.78,21.69 12.52,21.95 6.89,21.95 6.8,22.04
  Bottom Layer w0.254: 6.08,22.08 v2(6.82,22.08)
EPD_POWER_EN: length 11.4
  Top Layer w0.254: 13.54,33.68 13.59,33.62 14.86,33.62
  Inner3 w0.127: v2(14.08,33.71) 14.08,25.6 13.99,25.51 13.32,25.51 v2(12.86,25.05)
  Bottom Layer w0.254: v2(12.86,25.05) 12.88,25.02 12.88,24.59
EPD_RST: length 10.6
  Inner1 w0.127: v2(4.61,24.1) 14.1,24.1 v2(14.17,24.17)
  Bottom Layer w0.254: v2(4.61,24.1) 4.61,24.09 5.56,24.09
EPD_SCLK: length 20.1
  Inner1 w0.127: v2(24.61,23.44) 23.84,23.44 23.41,23.87 23.41,24.22 23.16,24.46 22.81,24.46 20.96,22.61 10.85,22.61 10.53,22.3 10.18,22.3 9.84,22.64 v2(7.39,22.64)
  Bottom Layer w0.254: 6.23,22.59 7.34,22.59 v2(7.39,22.64)
FULL_LED: length 29.8
  Top Layer w0.254: v2(23.71,6.4) 23.69,6.38 23.69,5.66
  Inner2 w0.127: 23.73,6.49 23.73,5.7 23.41,5.38 18.67,5.38 8.82,15.23 8.82,21.18 v2(10.35,22.72)
  Bottom Layer w0.254: v2(10.35,22.72) 10.35,23.7 10.33,23.72
GDR: length 5
  Top Layer w0.254: 2.53,30 3.77,28.77 ; 3.77,28.74 4.57,27.94 4.78,27.94
  Bottom Layer w0.254: 5.39,28.12 4.37,28.12 3.77,28.72
  vias: v2(3.78,28.77)
I2C_SCL: length 50.3
  Top Layer w0.127: 7.88,33.84 7.73,33.98 7.73,34.01 7.61,34.13 7.15,34.13 7.1,34.19 6.75,34.19 6.5,33.94 6.5,33.59 6.8,33.3 6.8,33.06 ; v2(9.03,9.87) 8.95,9.87 8.42,10.39 8.01,10.39 7.55,10.85 7.52,10.85 7.34,11.03 7.34,11.17 ; v2(21.54,25.22) 21.54,25.64 21.46,25.71
  Inner1 w0.127: v2(19.34,18.22) 19.34,13.22 16.17,10.04 12.91,10.04 arc(12.19,10.25) 11.48,10.04 arc(11.36,9.96) 11.25,9.87 v2(9.03,9.87)
  Inner2 w0.127: 19.41,18.22 21.34,20.16 21.34,21.72 21.53,21.9 21.53,25.24
  Inner4 w0.127: v2(6.8,33.11) 9.83,33.11 17.71,25.23 21.45,25.23
  Bottom Layer w0.254: 21.59,24.44 21.54,24.49 v2(21.54,25.22) ; 19.38,16.82 19.34,16.85 v2(19.34,18.22)
I2C_SDA: length 52.2
  Top Layer w0.127: 7.73,11.23 7.73,11.04 8.08,10.68 ; v2(9.06,10.51) 9.06,10.66 9.03,10.69 8.1,10.69 ; 7.32,33.77 6.93,33.77 v2(6.92,33.77) ; 21.49,27.97 21.56,27.9 21.56,27.44
  Inner3 w0.127: 20.7,16.32 20.7,23.87 20.89,24.06 20.89,24.41 20.7,24.6 20.7,27.24 21.5,28.04
  Inner4 w0.127: v2(20.65,16.21) 20.97,15.88 20.97,13.89 17.82,10.73 17.81,10.73 17.58,10.51 v2(9.06,10.51) ; v2(6.92,33.77) 12.79,33.77 18.51,28.04 v2(21.51,28.04)
  Bottom Layer w0.254: 21.45,28.02 21.47,28 25.89,28
MARK_KEY: length 41.8
  Top Layer w0.127: 16.56,23.41 16.78,23.64 v2(16.78,25.39) 16.8,25.37 17.6,25.37
  Inner2 w0.127: v2(6.86,39.85) 23.27,39.85 24.88,38.25 25.75,38.25 25.84,38.16 25.84,33.06 25.14,32.36 23.65,32.36 16.78,25.48 v2(16.78,25.39)
  Bottom Layer w0.254: v2(6.86,39.85) 7.33,39.38 8.51,39.38
MIC_LDO_EN: length 17.2
  Top Layer w0.254: v2(24.82,34.15) 24.22,34.15 24.13,34.06 ; v2(13.08,37.65) 13.89,38.47 14.54,38.47
  Inner2 w0.127: v2(13.08,37.65) 17.17,33.56 24.02,33.56 24.62,34.17 24.81,34.17
  Bottom Layer w0.254: 24.81,34.22 24.85,34.18 25.81,34.18
PDM_CLK: length 19.1
  Top Layer w0.127: v2(21.7,36.92) 21.72,36.9 23.14,36.9
  Top Layer w0.254: v2(6.3,38.47) 6.3,36.93 6.34,36.89
  Inner1 w0.127: v2(21.7,36.92) 20.16,38.47 v2(6.3,38.47)
PDM_DATA: length 18.7
  Top Layer w0.127: 23.07,35.66 21.8,35.66 21.65,35.52
  Top Layer w0.254: v2(5.35,35.53) 5.34,35.53 5.34,36.09
  Inner1 w0.127: v2(21.66,35.53) 21.66,35.53 9.54,35.53 9.18,35.89 8.84,35.89 8.48,35.53 v2(5.35,35.53)
PREVGH: length 35.8
  Top Layer w0.254: 18.61,26.56 v2(19.19,26.56)
  Inner3 w0.127: 1.17,22.14 5.59,26.56 8.29,26.56 9.79,25.07 10.14,25.07 12.69,27.62 13.6,27.62 13.85,27.38 13.85,26.17 13.41,25.74 12.95,25.74 12.44,25.22 12.44,24.87 12.68,24.63 13.43,24.63 14.3,25.5 14.3,26.13 14.83,26.66 15.18,26.66 15.27,26.56 v2(19.19,26.56)
  Bottom Layer w0.127: v2(1.19,22.1) 1.04,21.95 1.04,19.4 1.45,18.99 4.68,18.99 5.11,18.56 5.43,18.56
PREVGL: length 15.4
  Top Layer w0.127: 4.79,25.24 3.32,23.76 0.89,23.76 0.38,23.26 0.38,19.16 v2(0.83,18.71)
  Bottom Layer w0.127: 5.53,17.61 5.28,17.61 5.02,17.87 5.02,17.91 5,17.92 5,18.3 4.59,18.71 4.46,18.71 4.43,18.74 4.08,18.74 4.06,18.71 v2(0.83,18.71)
PWR_MODE: length 35.6
  Top Layer w0.127: 11.97,15.69 11.53,15.69 10.68,14.84 10.68,13.4 10.77,13.31 11.32,13.31
  Top Layer w0.254: 11.8,16.77 11.93,16.64 11.93,15.87
  Inner2 w0.254: v2(24.69,32.97) 11.67,32.97 10.97,32.26 10.97,17.59 v2(11.75,16.8)
  Bottom Layer w0.254: 25.76,32.94 24.72,32.94 v2(24.69,32.97)
REC_KEY: length 12.6
  Top Layer w0.127: v2(26.39,38.05) 19.96,38.05 18.03,36.12 18.03,36.09 17.9,35.96 17.87,35.96 16.69,34.78
  Top Layer w0.254: 16.66,36.4 16.66,35.05 16.53,34.92
REC_LED: length 44.5
  Top Layer w0.254: v2(18,2.32) 17.98,2.35 17.98,3.13
  Inner1 w0.127: v2(18,2.32) 25.71,2.32 26.81,3.42 26.81,18.91 25.1,20.62 12.1,20.62 v2(11.45,21.26)
  Bottom Layer w0.254: 11.54,23.82 11.45,23.72 v2(11.45,21.26)
RESE: length 8.6
  Top Layer w0.127: 1.57,26.69 2.08,26.69 2.45,26.31 6.01,26.31 6.35,26.66 6.35,27.93
  Top Layer w0.254: v2(7.03,28.39) 6.77,28.14 6.43,28.14
  Bottom Layer w0.254: v2(7.03,28.39) 7.03,27.74 6.91,27.63 6.15,27.63
RESET: length 5.4
  Top Layer w0.127: v2(24.9,39.25) 24.62,38.97 24.62,38.53 24.42,38.34 23.68,38.34 23.36,38.65 23.16,38.65
  Top Layer w0.254: 23.13,38.83 22.89,39.07 22.89,40.82
  Bottom Layer w0.254: 25.67,39.25 v2(24.9,39.25)
RTC_INT: length 22.2
  Top Layer w0.127: v2(19.28,19.64) 18.5,19.64 16.02,22.12 16.02,22.91 12.81,26.13 12.81,26.36 11.11,28.06 arc(11.05,28.21) 10.9,28.27 9.49,29.67 v2(9.49,34.36)
  Bottom Layer w0.127: 19.25,21.7 19.25,19.66 v2(19.28,19.64)
  Bottom Layer w0.254: 8.61,34.37 9.48,34.37 v2(9.49,34.36)
SD_CS: length 18.7
  Inner2 w0.127: v2(25.88,30.46) 25.88,22.84 26.04,22.68 26.04,18.2 22.65,14.81 21.93,14.81 v2(21.65,14.53)
  Bottom Layer w0.254: v2(21.65,14.53) 21.67,14.5 21.67,14.09
SD_MISO: length 4.2
  Top Layer w0.254: 15.81,27.16 15.96,27.31 v2(16.76,27.31)
  Bottom Layer w0.127: v2(16.76,27.31) 16.74,27.29 16.74,25.94 16.36,25.56 16.36,25.21 16.74,24.83 16.74,24.43
SD_MOSI: length 12
  Inner4 w0.127: v2(19.02,24.42) 19.02,20.69 v2(13.91,15.57)
  Bottom Layer w0.127: 13.98,14.52 13.98,15.51 v2(13.91,15.57)
SD_SCK: length 6.6
  Top Layer w0.254: 20.61,29.1 20.6,29.08 v2(19.68,29.08)
  Bottom Layer w0.254: 17.95,24.18 17.95,27.36 v2(19.68,29.08)
SYS_PWR: length 27.8
  Top Layer w0.127: 10.23,13.64 10.23,15.94
  Top Layer w0.254: 15.37,14.94 15.71,14.59 15.71,14.34 15.21,13.84 14.81,13.84 ; 10.13,13.52 10.11,13.55 8.65,13.55 ; 10.38,15.97 10.37,15.96 8.59,15.96 ; 22.82,18.49 23.02,18.29 v2(23.02,17.75) ; 11.85,14.96 11.88,14.93 15.37,14.93
  Inner2 w0.127: v2(9.53,16) 14.4,16 14.56,16.15 14.91,16.15 15.07,16 20.27,16 20.48,15.79 20.83,15.79 21.07,16.03 21.3,16.03 v2(23.02,17.75)
  Inner2 w0.254: 10.3,14.86 10.39,14.96 11.78,14.96
  vias: v2(10.24,14.84) v2(11.87,14.96)
USB_5V_PROT: length 16.1
  Top Layer w0.254: v2(3.56,13.21) 5.08,14.73 v2(5.33,14.73) ; v2(9.37,12.05) 8.63,11.32 8.63,11.32
  Bottom Layer w0.127: D2.5 6.63,15.5 6.63,15.4 6.6,15.37 6.6,15.27 6.15,14.82 5.42,14.82 v2(5.33,14.73)
  Bottom Layer w0.254: v2(3.56,13.21) 3.56,12.53 C21.2 4.06,11.85 R8.2 ; 6.77,15.58 6.71,15.64 6.71,16.1 7.03,16.42 7.43,16.42 9.37,14.48 v2(9.37,12.05)
USB_D+: length 34.8
  Top Layer w0.254: 22.89,25.71 23,25.82 v2(23,26.37)
  Inner4 w0.127: 23.01,26.33 23.46,25.88 23.46,19.62 18.93,15.09 18.93,13.93 18.06,13.05 16.89,13.05 16.77,12.93 16.64,12.93 16.62,12.94 12.23,12.94 12,13.17 5.48,13.17 5.21,12.9 4.33,12.9
  Bottom Layer w0.127: v2(4.41,12.9) 4.84,12.9 4.96,13.02 5.07,13.02 5.32,13.26 5.32,13.9 5.99,14.57 6.52,14.57 7.2,15.26 7.2,15.48
USB_D-: length 30.2
  Top Layer w0.254: 22.97,27.43 22.97,28.49 23.08,28.6
  Inner4 w0.127: v2(4.9,13.44) 5.34,13.88 5.34,13.9 11.6,20.16 11.83,20.16 16.53,24.87 21.21,24.87 21.34,24.74 21.74,24.74 22.07,25.08 22.07,27.61 v2(23.03,28.57)
  Bottom Layer w0.127: 6.18,15.58 5.76,15.15 5.16,15.15 4.91,14.91 4.91,14.31 4.9,14.29 v2(4.9,13.44)
VCOM: length 26.2
  Top Layer w0.127: 16.84,27.96 17.06,28.18 18.08,28.18 18.52,27.74
  Inner4 w0.127: v2(14.58,27.68) 11.55,27.68 7.48,23.61 6.73,23.61 6.48,23.37 6.48,22.48 3.88,19.87 3.73,19.87 v2(1.52,17.66)
  Bottom Layer w0.127: v2(1.52,17.66) 1.84,17.34 4.87,17.34 5.12,17.1 5.47,17.1 ; v2(14.58,27.68) 14.81,27.92 16.84,27.92 v2(16.84,27.91)
$1N2: length 14.6
  Top Layer w0.254: 9.25,7.91 9.25,7.96 ; 9.25,7.91 9.25,7.85 9.77,7.33 11.08,7.33 12.05,6.37 12.31,6.37 ; 9.25,7.91 v2(8.59,7.25)
  Bottom Layer w0.127: v2(8.59,7.25) 8.63,7.21 8.63,6.8 ; USB2.B4A9 3.82,5.77 4.05,5.55 4.05,5.1 4.32,4.83 8.13,4.83 8.4,5.1 8.4,5.55 8.62,5.77 USB2.A4B9
  Bottom Layer w0.254: USB2.B4A9 3.82,8.22 R8.1
$1N5: length 11.4
  Inner1 w0.127: v2(5.79,12.75) 6.15,12.39 6.17,12.39 6.3,12.26 6.3,12.24 6.56,11.98 6.56,7.45
  Bottom Layer w0.127: 6.49,6.49 6.53,6.53 6.53,7.74 6.35,7.92 5.65,7.92 5.48,7.75 5.48,6.71 ; v2(5.79,12.75) 6.52,12.75 7.25,13.48 7.25,13.99 7.28,14.02
  vias: v2(6.55,7.45)
$1N6: length 12.7
  Inner1 w0.127: v2(5.83,13.7) 6.95,12.58 6.95,7.64 6.97,7.62 6.97,7.28 6.95,7.26 6.95,5.26
  Bottom Layer w0.127: USB2.A7 5.97,6.32 5.97,5.29 6.11,5.14 6.85,5.14 6.97,5.27 USB2.B7
  Bottom Layer w0.254: 6.25,14.09 6.21,14.09 v2(5.83,13.7)
  vias: v2(6.93,5.25)
$1N18: length 2.9
  Top Layer w0.127: R2.2 7.62,5.26 v2(7.62,5.33)
  Bottom Layer w0.127: 7.47,6.32 7.47,5.48 v2(7.62,5.33)
$1N43: length 18
  Top Layer w0.127: v2(11.53,14.27) 11.51,14.25 11.51,13.83
  Top Layer w0.254: v2(21.82,21.6) 21.83,21.61 22.73,21.61
  Inner4 w0.127: v2(11.53,14.27) 14.52,14.27 14.81,13.98 15.16,13.98 15.51,14.34 17.4,14.34 21.9,18.84 21.9,19.85 21.82,19.93 21.82,21.56
  Bottom Layer w0.254: v2(21.82,21.6) 21.82,21.45 22.66,20.6
$1N49: length 3.6
  Top Layer w0.127: 11.33,12.81 11.31,12.83 10.28,12.83 10.22,12.77 ; C2.1 10.14,10.56 10.14,12.66
$1N50: length 11.8
  Top Layer w0.127: 15.38,13.32 15.37,13.32 14.74,13.32
  Top Layer w0.254: L1.1 24.6,12.89 v2(24.25,13.24)
  Inner2 w0.127: v2(15.44,13.36) 15.6,13.21 24.22,13.21 v2(24.25,13.24)
$1N51: length 7.1
  Top Layer w0.127: 21.24,11.05 16.87,11.05 15.6,12.32 14.74,12.32 14.72,12.3
$1N121: length 7.2
  Top Layer w0.254: 20.34,7.13 20.34,8.08 20.34,8.09
  Inner1 w0.254: v2(22.28,8.98) 22.18,8.98 21.34,8.14 v2(20.37,8.14)
  Bottom Layer w0.254: 22.51,13.97 22.51,12.67 22.39,12.55 ; 22.24,11.46 22.24,9.01 v2(22.28,8.98)
$1N122: length 10.6
  Top Layer w0.254: 21.59,8.34 21.59,8.77 v2(21.44,8.93)
  Bottom Layer w0.254: 15.1,14.32 15.58,13.85 15.64,13.85 15.93,13.56 15.93,13.5 16.11,13.32 21.01,13.32 21.19,13.14 21.19,12.41 21.19,12.41 ; 21.23,11.4 21.23,9.14 v2(21.44,8.93)
  vias: v2(14.99,14.4)
$1N123: length 29.3
  Top Layer w0.254: 22.28,28.74 21.94,29.08 21.58,29.08
  Inner3 w0.127: 22.29,18.47 22.29,11.82 22.24,11.76 ; 22.24,11.76 20.89,10.41 v2(19.09,10.41) ; 22.24,11.76 22.24,28.75 22.26,28.76
  Bottom Layer w0.254: v2(19.09,10.41) 19.11,10.43 19.11,11.42
  vias: v2(22.23,28.74)
$1N125: length 3.6
  Top Layer w0.254: 23.08,8.36 23.42,8.69 v2(23.42,9.12)
  Bottom Layer w0.254: v2(23.42,9.12) 23.42,11.6 23.55,11.73
$1N127: length 22.7
  Top Layer w0.127: 15.82,26.24 v2(15.01,26.24)
  Top Layer w0.254: 17.65,8.47 17.21,8.91 v2(16.86,8.91)
  Inner3 w0.127: v2(15.01,26.24) 16.89,24.36 16.89,8.88
  Bottom Layer w0.254: 16.82,11.71 16.82,8.95 v2(16.86,8.91)
$1N184: length 27.3
  Inner2 w0.127: v2(3.88,40.66) 1.89,40.66 0.65,39.42 0.65,26.35 v2(6.88,20.11)
  Bottom Layer w0.254: 4.62,40.66 4.61,40.66 v2(3.88,40.66) ; v2(6.88,20.11) 6.87,20.13 5.98,20.13
$1N185: length 1.8
  Top Layer w0.254: 7.96,19.28 7.79,19.11 v2(6.86,19.11)
  Bottom Layer w0.254: v2(6.86,19.11) 6.28,19.11 6.24,19.06
$1N188: length 27.5
  Inner2 w0.127: v2(1.21,40.62) 0.42,39.83 0.42,24.74 v2(7.08,18.08)
  Bottom Layer w0.254: 5.92,18.04 5.96,18.08 v2(7.08,18.08) ; v2(1.21,40.62) 1.86,40.62 1.89,40.59
$1N199: length 3.4
  Top Layer w0.254: 3.18,22.03 3.18,20.85 2.69,20.36 ; 3.5,22.07 4.88,22.07 4.95,22.14
$1N200: length 18.9
  Top Layer w0.254: v2(1.48,24.57) 1.48,25.47 ; v2(1.69,19.42) 1.7,19.43 2.4,19.43 ; 8.92,27.4 8.92,29.12 8.34,29.7 7.08,29.7 7.06,29.68 v2(5.51,29.68)
  Inner1 w0.254: 1.45,24.71 1.45,25.62 v2(5.51,29.68)
  Bottom Layer w0.254: v2(1.69,19.42) 1.69,24.37 v2(1.48,24.57)
$1N212: length 2.3
  Top Layer w0.254: 3.3,27 3.92,27 v2(3.93,27.02)
  Bottom Layer w0.254: 5.47,26.6 4.34,26.6 v2(3.93,27.02)
$1N218: length 1.6
  Top Layer w0.254: 10.55,33.63 10.55,33.63 10.55,35.24
$1N241: length 4.2
  Top Layer w0.254: v2(15.12,7.98) 15.12,7.98 15.52,7.98
  Bottom Layer w0.254: v2(15.12,7.98) 15.72,8.58 15.72,11.54
$1N256: length 6.6
  Bottom Layer w0.254: 13.79,16.61 13.79,17.85 13.99,18.05 ; 17.93,21.22 17.99,21.16 17.99,20.47 15.53,18 14.75,18
$1N257: length 3.7
  Bottom Layer w0.254: 14.81,22.09 16.63,22.09 16.69,22.15 ; 14.5,20.42 14.62,20.54 14.62,22.14
$1N288: length 2
  Top Layer w0.254: 20.03,3.94 19.92,4.05 18.08,4.05
$1N294: length 1.9
  Top Layer w0.254: 22.29,3.83 22.29,5.46 22.51,5.68
$1N297: length 1.9
  Top Layer w0.254: 24.13,3.83 24.6,4.3 24.6,5.53
$1N309: length 2
  Top Layer w0.127: 8.06,10.01 7.46,10.62 7.09,10.62 6.96,10.74 6.96,11.31 6.97,11.32
$1N348: length 8.2
  Top Layer w0.127: 1.36,34.14 2.51,34.14 v2(2.53,34.16)
  Inner2 w0.127: 8.47,36.76 5.13,36.76 v2(2.53,34.16)
  vias: v2(8.52,36.75)
$1N355: length 8.3
  Top Layer w0.127: v2(2.53,35.1) 2.51,35.08 1.3,35.08
  Inner1 w0.127: v2(8.47,37.92) 5.35,37.92 v2(2.53,35.1)
$1N383: length 1.6
  Top Layer w0.254: v2(24.82,36.89) 24.26,36.89 24.25,36.88
  Bottom Layer w0.254: 25.77,36.73 24.98,36.73 v2(24.82,36.89)
$1N385: length 1.4
  Top Layer w0.254: v2(24.87,35.64) 24.86,35.62 24.24,35.62
  Bottom Layer w0.254: 25.64,35.59 25.59,35.64 v2(24.87,35.64)
$1N388: length 6.8
  Top Layer w0.254: 12.37,28.25 11.62,28.25 v2(11.58,28.2)
  Bottom Layer w0.127: v2(11.58,28.2) 11.58,30.49 8.95,33.11
$1N390: length 23.2
  Top Layer w0.254: 3.26,17.84 3.21,17.78 v2(2.62,17.78)
  Inner1 w0.127: 2.55,17.78 0.4,19.92 0.4,31.22 0.49,31.31 6.07,31.31 v2(6.51,31.76)
  Bottom Layer w0.254: 8.32,31.71 8.28,31.76 v2(6.51,31.76)
$1N392: length 13.7
  Top Layer w0.254: 4.24,20.29 3.71,20.29 v2(3.7,20.29)
  Inner1 w0.127: v2(8.35,30.46) 7.99,30.46 2.74,25.2 2.74,21.26 v2(3.7,20.29)
$1N397: length 2.1
  Top Layer w0.254: v2(24.74,26.78) 24.62,26.78 23.86,27.54
  Bottom Layer w0.254: v2(24.74,26.78) 25.6,26.78 25.62,26.77
$1N398: length 1.9
  Top Layer w0.254: 23.94,25.77 24.69,25.77 v2(24.7,25.78)
  Bottom Layer w0.254: 25.88,25.41 25.14,25.41 24.85,25.7
$1N405: length 2.4
  Top Layer w0.254: R3.1 v2(4.57,5.33)
  Bottom Layer w0.254: v2(4.57,5.33) 4.47,5.43 4.47,6.32

## Copper pours and planes (outline as drawn; the poured copper is in the pictures)
GND on Top Layer: -0.28,43.75 26.94,43.75 26.94,-0.08 -0.28,-0.08
GND on Top Layer: 0,43.69 27.18,43.69 27.18,0 0,0
GND on Bottom Layer: 0,43.69 27.18,43.69 27.18,0 0,0
GND on Bottom Layer: 0,43.69 27.18,43.69 27.18,0 0,0
GND on Inner3: 0,43.69 27.18,43.69 27.18,0 0,0
GND on Inner4: 0,43.69 27.18,43.69 27.18,0 0,0
